# Altium project firebold.PrjPcb
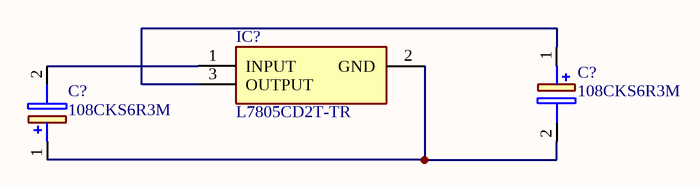
[diagram p0: Sheet1.SchDoc]
1 sheet, 3 parts. Net scope: global (net labels, ports and power ports of the same name join across sheets).
Board file: PCB1.PcbDoc

## Sheet Sheet1.SchDoc
size A4; SheetNumber: 1; SheetTotal: 1

### Parts
(Parts that share a designator on the sheet are numbered #1, #2 ... from top to bottom, then left to right.)
C?#1  108CKS6R3M  [CAPPRD350W55D850H1300]
C?#2  108CKS6R3M  [CAPPRD350W55D850H1300]
IC?  L7805CD2T-TR  [L7805CD2T]

### Nets
NetC?#1_1: C?#1.1(+) IC?.3(OUTPUT)
NetC?#1_2: C?#1.2(-) C?#2.1(+) IC?.2(GND)
NetC?#2_2: C?#2.2(-) IC?.1(INPUT)

### Library data of the parts
C?#1 C?#2 = 108CKS6R3M: Capacitor Polarised; Manufacturer_Name: ILLINOIS CAPACITOR; Datasheet Link: http://www.illinoiscapacitor.com/ic_search/lytics_products_detail.aspx?icpartnumber=247; Height: 13mm; Manufacturer_Part_Number: 108CKS6R3M; Mouser Part Number: 598-108CKS6R3M; Mouser Price/Stock: https://www.mouser.com/Search/Refine.aspx?Keyword=598-108CKS6R3M
IC? = L7805CD2T-TR: Integrated Circuit; Manufacturer_Name: STMicroelectronics; Datasheet Link: http://www.st.com/web/en/resource/technical/document/datasheet/CD00000444.pdf; Height: 4.56mm; Manufacturer_Part_Number: L7805CD2T-TR; Mouser Part Number: 511-L7805CD2T-TR; Mouser Price/Stock: https://www.mouser.co.uk/ProductDetail/STMicroelectronics/L7805CD2T-TR?qs=8tkG3v2%2F4sGtQPO74MZjHw%3D%3D; Arrow Part Number: L7805CD2T-TR; Arrow Price/Stock: https://www.arrow.com/en/products/l7805cd2t-tr/stmicroelectronics?region=europe